# EAGLE design Arduino Keyboard (EAGLE 9.6.0)
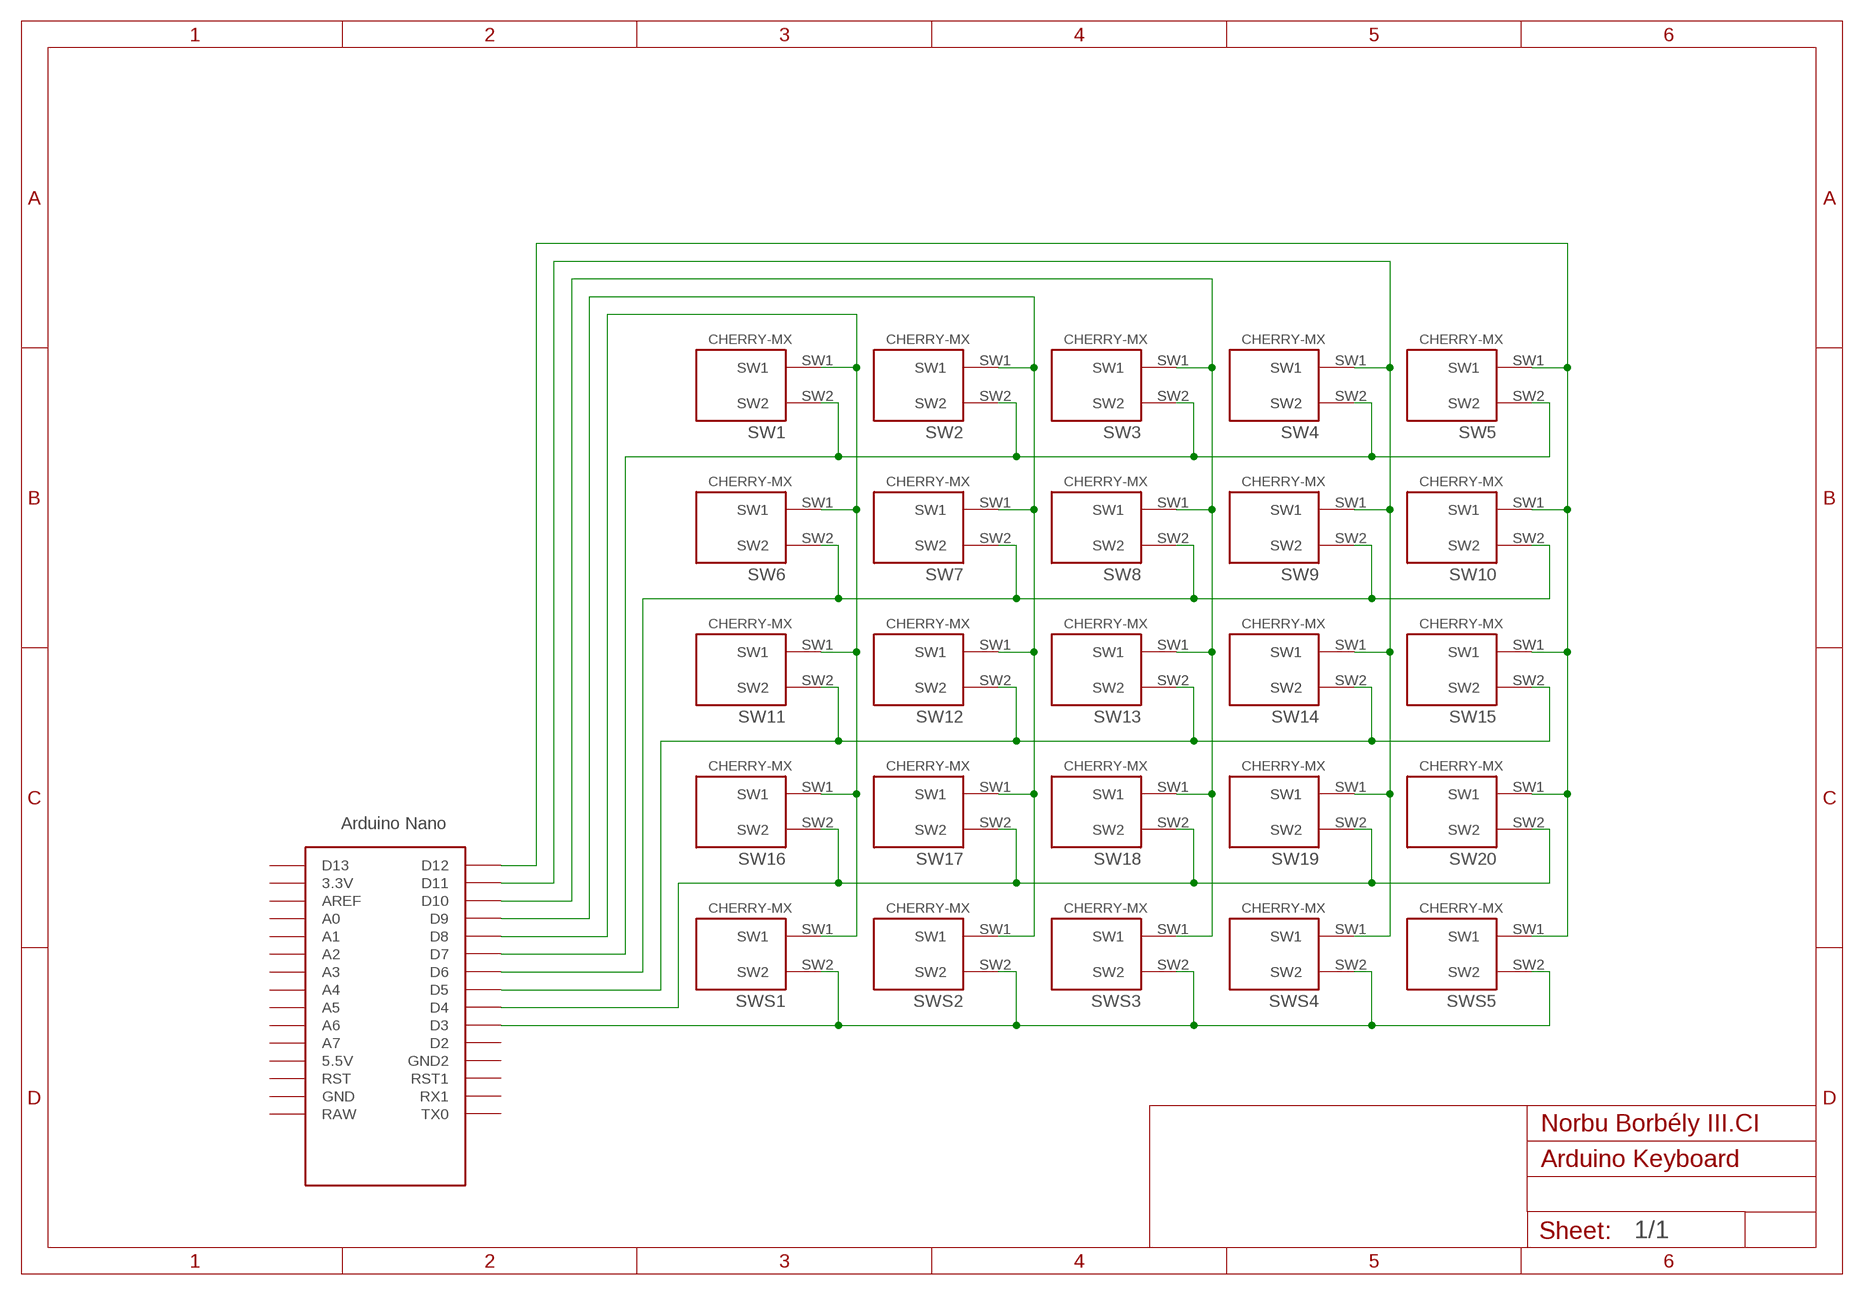
[diagram p0: schematic, sheet 1]

## Parts
SW1  CHERRY-MXSTANDARD  [CHERRY-MX]
SW2  CHERRY-MXSTANDARD  [CHERRY-MX]
SW3  CHERRY-MXSTANDARD  [CHERRY-MX]
SW4  CHERRY-MXSTANDARD  [CHERRY-MX]
SW5  CHERRY-MXSTANDARD  [CHERRY-MX]
SW6  CHERRY-MXSTANDARD  [CHERRY-MX]
SW7  CHERRY-MXSTANDARD  [CHERRY-MX]
SW8  CHERRY-MXSTANDARD  [CHERRY-MX]
SW9  CHERRY-MXSTANDARD  [CHERRY-MX]
SW10  CHERRY-MXSTANDARD  [CHERRY-MX]
SW11  CHERRY-MXSTANDARD  [CHERRY-MX]
SW12  CHERRY-MXSTANDARD  [CHERRY-MX]
SW13  CHERRY-MXSTANDARD  [CHERRY-MX]
SW14  CHERRY-MXSTANDARD  [CHERRY-MX]
SW15  CHERRY-MXSTANDARD  [CHERRY-MX]
SW16  CHERRY-MXSTANDARD  [CHERRY-MX]
SW17  CHERRY-MXSTANDARD  [CHERRY-MX]
SW18  CHERRY-MXSTANDARD  [CHERRY-MX]
SW19  CHERRY-MXSTANDARD  [CHERRY-MX]
SW20  CHERRY-MXSTANDARD  [CHERRY-MX]
SWS1  CHERRY-MXSTANDARD  [CHERRY-MX]
SWS2  CHERRY-MXSTANDARD  [CHERRY-MX]
SWS3  CHERRY-MXSTANDARD  [CHERRY-MX]
SWS4  CHERRY-MXSTANDARD  [CHERRY-MX]
SWS5  CHERRY-MXSTANDARD  [CHERRY-MX]
U$1  NANO  [NANO]

## Nets
N$1: SWS1.SW2 SWS2.SW2 SWS3.SW2 SWS4.SW2 SWS5.SW2 U$1.D3
N$2: SW16.SW2 SW17.SW2 SW18.SW2 SW19.SW2 SW20.SW2 U$1.D4
N$3: SW11.SW2 SW12.SW2 SW13.SW2 SW14.SW2 SW15.SW2 U$1.D5
N$4: SW6.SW2 SW7.SW2 SW8.SW2 SW9.SW2 SW10.SW2 U$1.D6
N$5: SW1.SW2 SW2.SW2 SW3.SW2 SW4.SW2 SW5.SW2 U$1.D7
N$6: SW1.SW1 SW6.SW1 SW11.SW1 SW16.SW1 SWS1.SW1 U$1.D8
N$7: SW2.SW1 SW7.SW1 SW12.SW1 SW17.SW1 SWS2.SW1 U$1.D9
N$8: SW3.SW1 SW8.SW1 SW13.SW1 SW18.SW1 SWS3.SW1 U$1.D10
N$9: SW4.SW1 SW9.SW1 SW14.SW1 SW19.SW1 SWS4.SW1 U$1.D11
N$10: SW5.SW1 SW10.SW1 SW15.SW1 SW20.SW1 SWS5.SW1 U$1.D12
Unconnected: U$1.3.3V U$1.5V(5.5V) U$1.A0 U$1.A1 U$1.A2 U$1.A3 U$1.A4 U$1.A5 U$1.A6 U$1.A7 U$1.AREF U$1.D2 U$1.D13 U$1.GND U$1.GND1(GND2) U$1.RAW U$1.RST U$1.RST1 U$1.RX1 U$1.TX0

## Notes on the sheet
- Norbu Borbély III.CI

## Library data of the parts
SW1-SW20 SWS1-SWS5 = cherrymx:CHERRY-MX: Cherry MX series keyswitch
U$1 = Arduino-clone_2:NANO: Arduino Nano

## Board
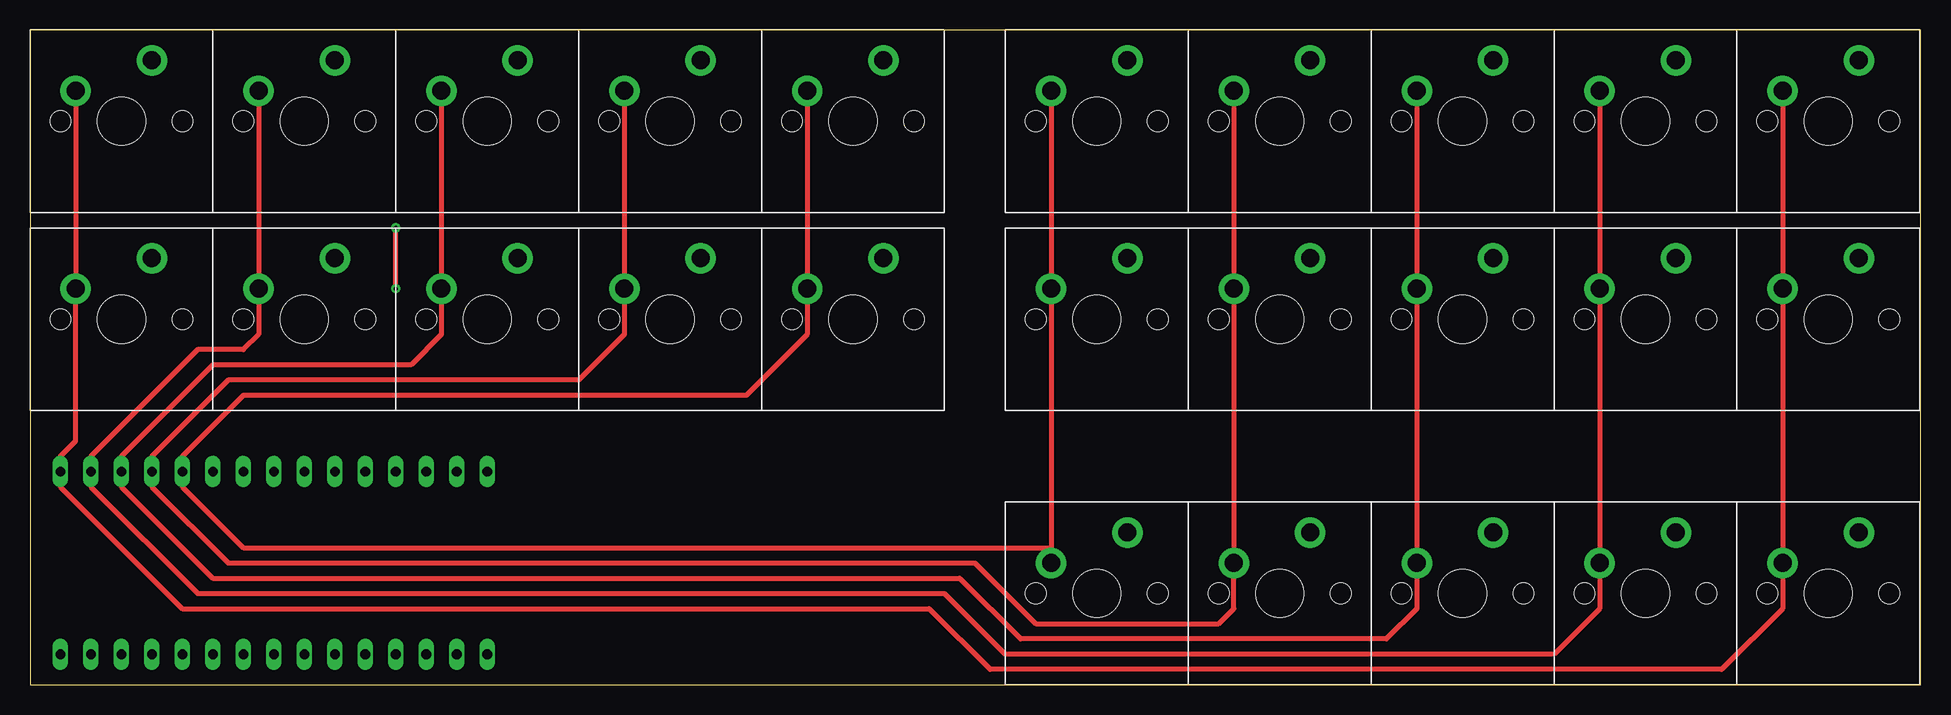
[diagram p1: board, top side]
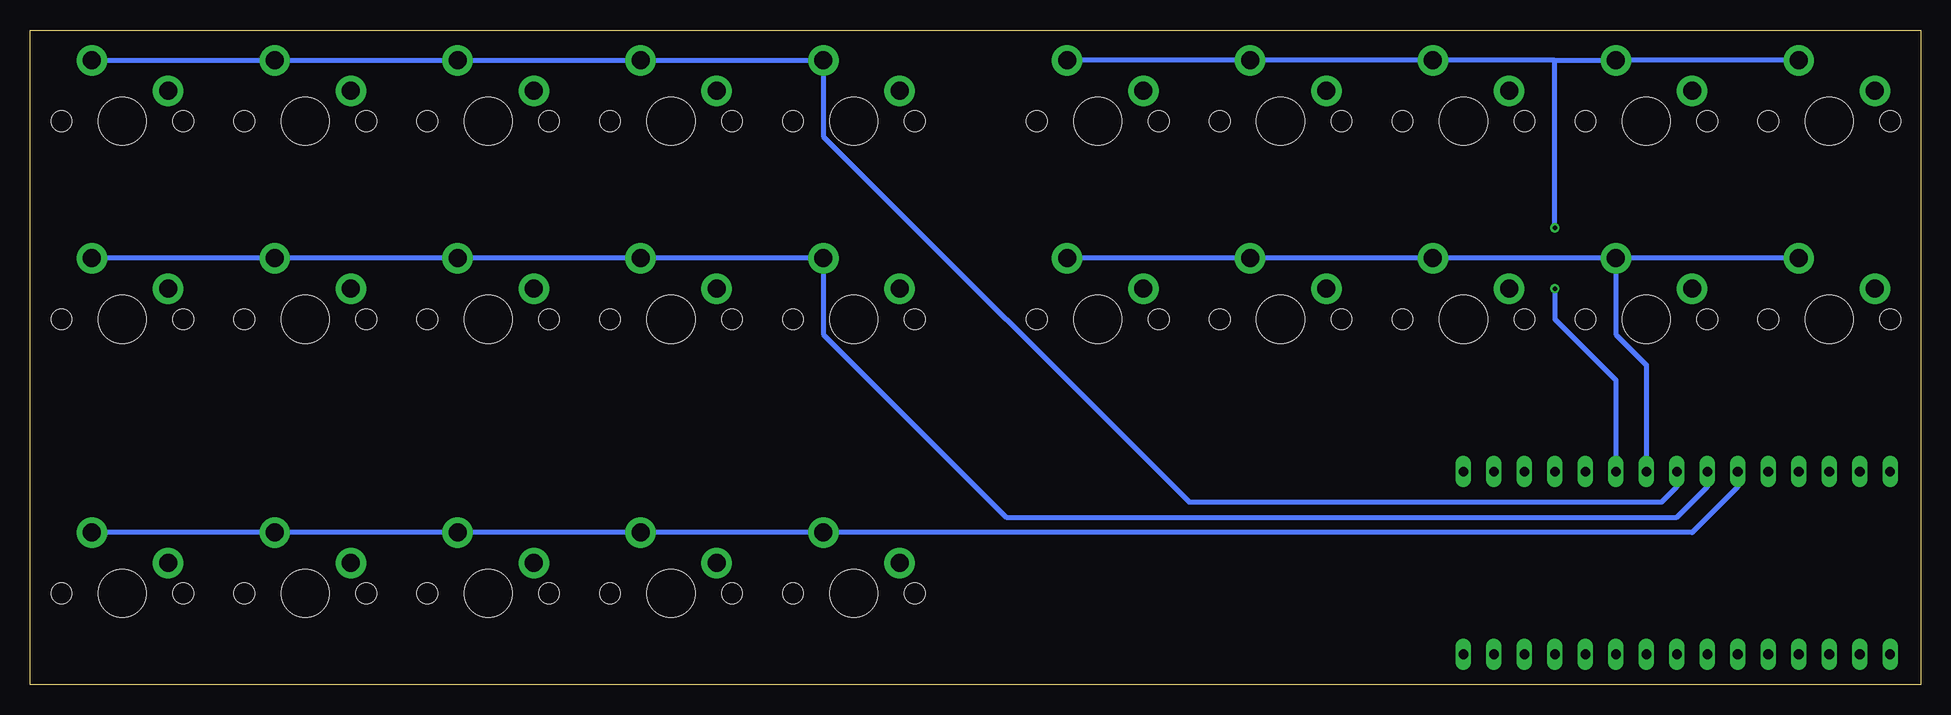
[diagram p2: board, bottom side, seen from below]

Size 157.56 x 54.6 mm. Coordinates in mm from the lower left corner, seen from the top.
Outline: 0,0 157.56,0 157.56,54.6 0,54.6 0,0
Copper layers (1*16): Top 0.035mm / dielectric 1.5mm / Bottom 0.035mm
Design rules "default": minimum track width 6mil, minimum drill 0.35mm, track to track 6mil, track to pad 6mil, pad to pad 6mil, via to via 6mil, smd to smd 6mil, copper to edge 40mil, drill to drill 6mil, minimum pad ring 10mil, minimum via ring 8mil, stop-mask expansion 4mil, vias tented up to drill 0mil, thermal gap 10mil

### Footprints (pad centres in the part's own frame; a part is rotated, then mirrored left to right if it is on the bottom)
CHERRY-MX = drill 1.5 pad 2.54: SW1 -3.81,2.54; SW2 2.54,5.08 | hole 4: 0,0 | hole 1.714: 5.08,0; -5.08,0
NANO = drill 0.8 long: 3.3V -10.16,24.13; 5V -10.16,-1.27; A0 -10.16,19.05; A1 -10.16,16.51; A2 -10.16,13.97; A3 -10.16,11.43; A4 -10.16,8.89; A5 -10.16,6.35; A6 -10.16,3.81; A7 -10.16,1.27; AREF -10.16,21.59; D2 5.08,1.27; D3 5.08,3.81; D4 5.08,6.35; D5 5.08,8.89; D6 5.08,11.43; D7 5.08,13.97; D8 5.08,16.51; D9 5.08,19.05; D10 5.08,21.59; D11 5.08,24.13; D12 5.08,26.67; D13 -10.16,26.67; GND -10.16,-6.35; GND1 5.08,-1.27; RAW -10.16,-8.89; RST -10.16,-3.81; RST1 5.08,-3.81; RX1 5.08,-6.35; TX0 5.08,-8.89

### Placement (x,y rotation side)
SW1  88.9,7.62 0 top
SW2  104.14,7.62 0 top
SW3  119.38,7.62 0 top
SW4  134.62,7.62 0 top
SW5  149.86,7.62 0 top
SW6  88.9,30.48 0 top
SW7  104.14,30.48 0 top
SW8  119.38,30.48 0 top
SW9  134.62,30.48 0 top
SW10  149.86,30.48 0 top
SW11  88.9,46.99 0 top
SW12  104.14,46.99 0 top
SW13  119.38,46.99 0 top
SW14  134.62,46.99 0 top
SW15  149.86,46.99 0 top
SW16  68.58,30.48 0 top
SW17  53.34,30.48 0 top
SW18  38.1,30.48 0 top
SW19  22.86,30.48 0 top
SW20  7.62,30.48 0 top
SWS1  68.58,46.99 0 top
SWS2  53.34,46.99 0 top
SWS3  38.1,46.99 0 top
SWS4  22.86,46.99 0 top
SWS5  7.62,46.99 0 top
U$1  29.21,12.7 90 top

### Tracks (layer width: path | path; a pad name or v marks a point on that pad's centre or on a via)
N$1  (via drill 0.35)
  Top 0.406: v30.48,33.02 v30.48,38.1
  Bottom 0.406: v30.48,33.02 30.48,30.48 25.4,25.4 U$1.D3 | v30.48,38.1 30.48,52.07 | 30.48,52.07 SWS4.SW2 SWS5.SW2 | 30.48,52.07 SWS3.SW2 SWS2.SW2 SWS1.SW2
N$2
  Bottom 0.406: SW19.SW2 25.4,29.21 22.86,26.67 U$1.D4 | SW20.SW2 SW19.SW2 | SW19.SW2 SW18.SW2 SW17.SW2 SW16.SW2
N$3
  Bottom 0.406: U$1.D5 20.32,16.51 21.59,15.24 60.96,15.24 91.44,45.72 SW11.SW2 SW12.SW2 SW13.SW2 SW14.SW2 SW15.SW2
N$4
  Bottom 0.406: U$1.D6 17.78,16.51 20.32,13.97 76.2,13.97 91.44,29.21 SW6.SW2 SW7.SW2 SW8.SW2 SW9.SW2 SW10.SW2
N$5
  Bottom 0.406: 151.13,12.7 SW5.SW2 SW4.SW2 SW3.SW2 SW2.SW2 SW1.SW2 19.05,12.7 15.24,16.51 U$1.D7
N$6
  Top 0.406: SWS1.SW1 SW16.SW1 64.77,29.21 59.69,24.13 17.78,24.13 12.7,19.05 U$1.D8 12.7,16.51 17.78,11.43 85.09,11.43 | SW11.SW1 SW6.SW1 85.09,11.43 | 85.09,11.43 SW1.SW1
N$7
  Top 0.406: SWS2.SW1 SW17.SW1 49.53,29.21 45.72,25.4 16.51,25.4 10.16,19.05 U$1.D9 10.16,16.51 16.51,10.16 78.74,10.16 83.82,5.08 99.06,5.08 100.33,6.35 SW2.SW1 SW7.SW1 SW12.SW1
N$8
  Top 0.406: SWS3.SW1 SW18.SW1 34.29,29.21 31.75,26.67 15.24,26.67 7.62,19.05 U$1.D10 7.62,16.51 15.24,8.89 77.47,8.89 82.55,3.81 113.03,3.81 115.57,6.35 SW3.SW1 SW8.SW1 SW13.SW1
N$9
  Top 0.406: SWS4.SW1 SW19.SW1 19.05,29.21 17.78,27.94 13.97,27.94 5.08,19.05 U$1.D11 5.08,16.51 13.97,7.62 76.2,7.62 81.28,2.54 127,2.54 130.81,6.35 SW4.SW1 SW9.SW1 SW14.SW1
N$10
  Top 0.406: SWS5.SW1 SW20.SW1 3.81,20.32 2.54,19.05 U$1.D12 2.54,16.51 12.7,6.35 74.93,6.35 80.01,1.27 140.97,1.27 146.05,6.35 SW5.SW1 SW10.SW1 SW15.SW1